# EAGLE design SmartBMSv2 (EAGLE 9.6.2)
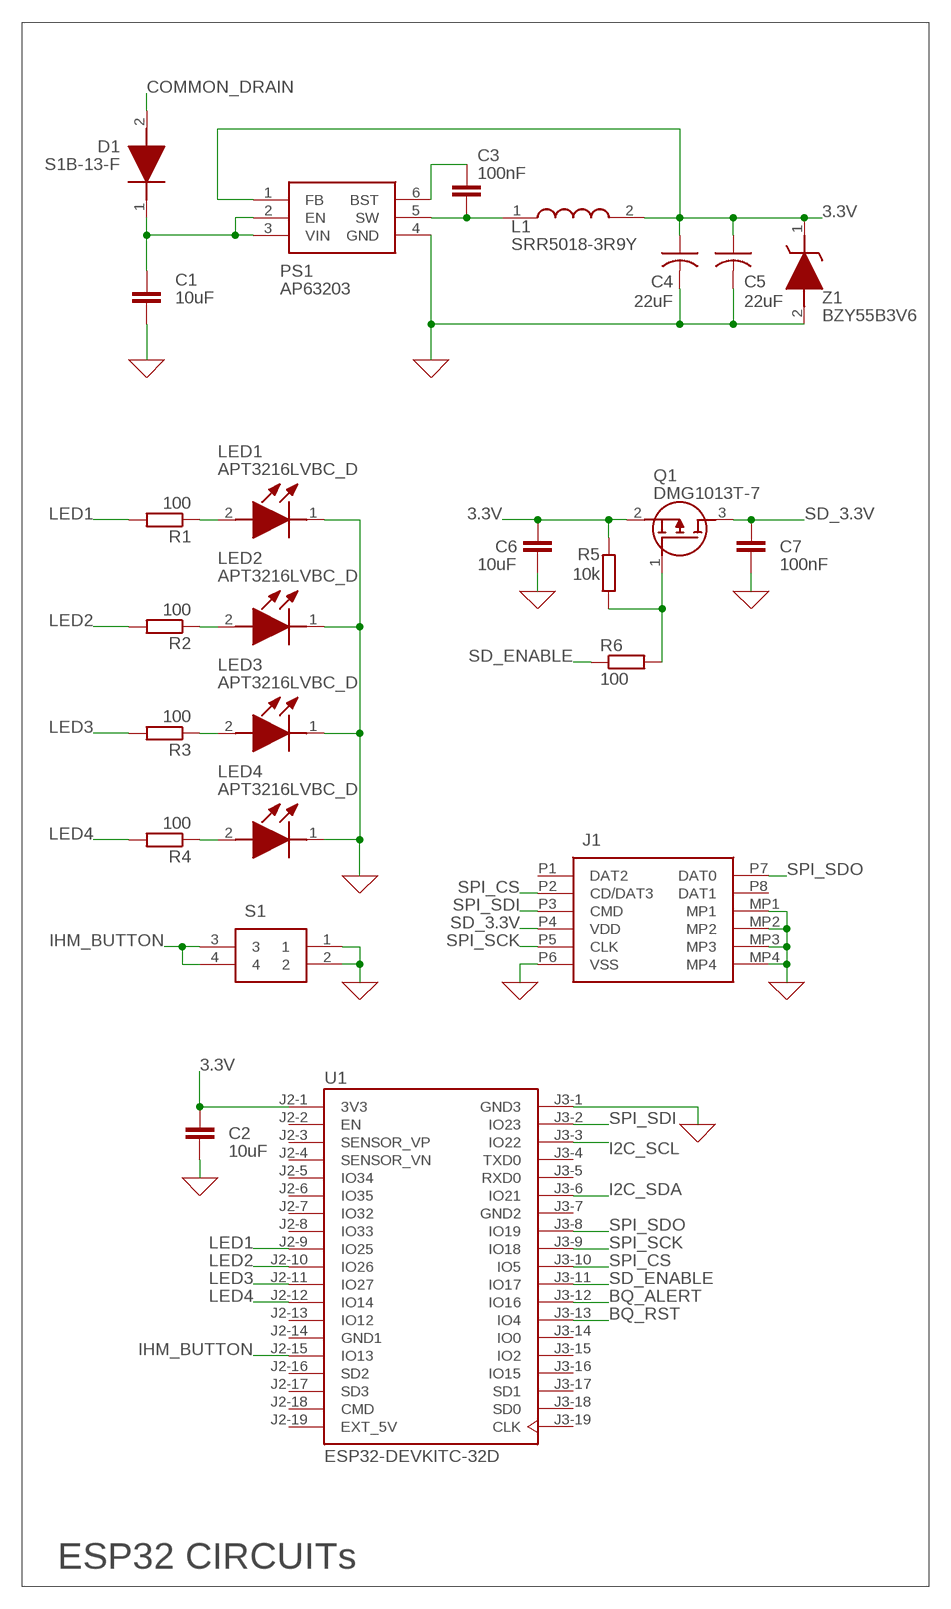
[diagram p0: schematic, sheet 1, part 1 of 2]
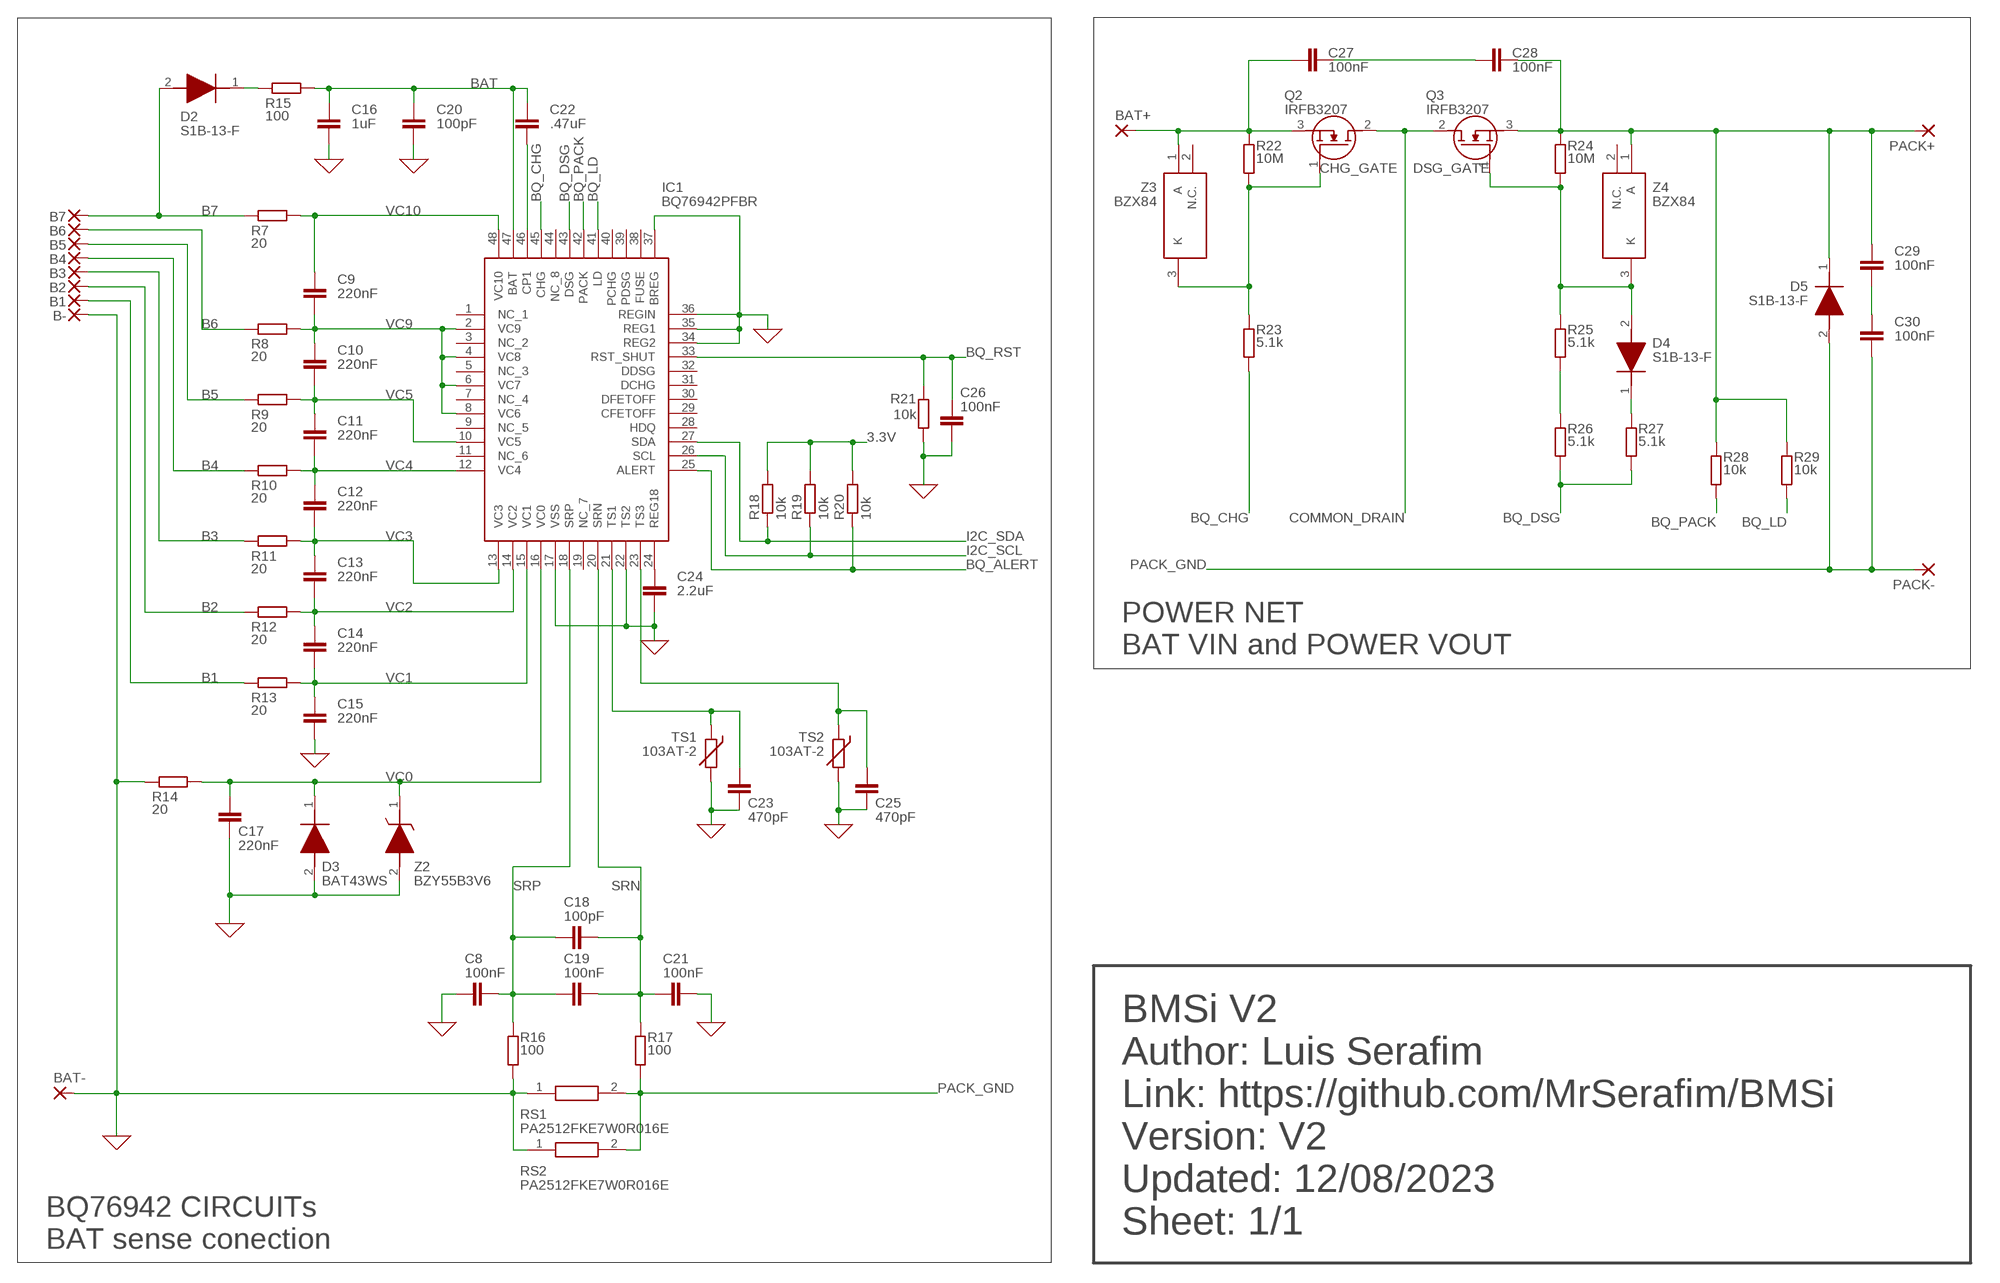
[diagram p1: schematic, sheet 1, part 2 of 2]

## Parts
B1  SMD5  [SMD2,54-5,08]
B2  SMD5  [SMD2,54-5,08]
B3  SMD5  [SMD2,54-5,08]
B4  SMD5  [SMD2,54-5,08]
B5  SMD5  [SMD2,54-5,08]
B6  SMD5  [SMD2,54-5,08]
B7  SMD5  [SMD2,54-5,08]
B-  SMD5  [SMD2,54-5,08]
BAT+  SMD5X10  [SMD5-10]
BAT-  SMD5X10  [SMD5-10]
C1  10uF  C-EUC0805  [C0805]
C2  10uF  C-EUC0805  [C0805]
C3  100nF  C-EUC0805  [C0805]
C4  22uF  C-USC0805  [C0805]
C5  22uF  C-USC0805  [C0805]
C6  10uF  C-EUC0805  [C0805]
C7  100nF  C-EUC0805  [C0805]
C8  100nF  C-EUC0805  [C0805]
C9  220nF  C-EUC0805  [C0805]
C10  220nF  C-EUC0805  [C0805]
C11  220nF  C-EUC0805  [C0805]
C12  220nF  C-EUC0805  [C0805]
C13  220nF  C-EUC0805  [C0805]
C14  220nF  C-EUC0805  [C0805]
C15  220nF  C-EUC0805  [C0805]
C16  1uF  C-EUC0805  [C0805]
C17  220nF  C-EUC0805  [C0805]
C18  100pF  C-EUC0805  [C0805]
C19  100nF  C-EUC0805  [C0805]
C20  100pF  C-EUC0805  [C0805]
C21  100nF  C-EUC0805  [C0805]
C22  .47uF  C-EUC0805  [C0805]
C23  470pF  C-EUC0805  [C0805]
C24  2.2uF  C-EUC0805  [C0805]
C25  470pF  C-EUC0805  [C0805]
C26  100nF  C-EUC0805  [C0805]
C27  100nF  C-EUC0805  [C0805]
C28  100nF  C-EUC0805  [C0805]
C29  100nF  C-EUC0805  [C0805]
C30  100nF  C-EUC0805  [C0805]
D1  S1B-13-F  [DIONM5126X230N]
D2  S1B-13-F  [DIONM5126X230N]
D3  BAT43WS  BAT43WS-E3-08  [SOD2713X115N]
D4  S1B-13-F  [DIONM5126X230N]
D5  S1B-13-F  [DIONM5126X230N]
IC1  BQ76942PFBR  [QFP50P900X900X120-48N]
J1  MEM2067-02-180-00-A  [MEM20670218000A]
L1  SRR5018-3R9Y  [SRR50183R9Y]
LED1  APT3216LVBC_D  [LEDC3216X95N]
LED2  APT3216LVBC_D  [LEDC3216X95N]
LED3  APT3216LVBC_D  [LEDC3216X95N]
LED4  APT3216LVBC_D  [LEDC3216X95N]
PACK+  SMD5X10  [SMD5-10]
PACK-  SMD5X10  [SMD5-10]
PS1  AP63203  AP63203WU-7  [SOT95P280X100-6N]
Q1  DMG1013T-7  [SOT50P160X90-3N]
Q2  IRFB3207  IRFB3207PBF_HOR  [TO220_HORIZONTAL]
Q3  IRFB3207  IRFB3207PBF_HOR  [TO220_HORIZONTAL]
R1  100  R-EU_R0805  [R0805]
R2  100  R-EU_R0805  [R0805]
R3  100  R-EU_R0805  [R0805]
R4  100  R-EU_R0805  [R0805]
R5  10k  R-EU_R0805  [R0805]
R6  100  R-EU_R0805  [R0805]
R7  20  R-EU_R0805  [R0805]
R8  20  R-EU_R0805  [R0805]
R9  20  R-EU_R0805  [R0805]
R10  20  R-EU_R0805  [R0805]
R11  20  R-EU_R0805  [R0805]
R12  20  R-EU_R0805  [R0805]
R13  20  R-EU_R0805  [R0805]
R14  20  R-EU_R0805  [R0805]
R15  100  R-EU_R0805  [R0805]
R16  100  R-EU_R0805  [R0805]
R17  100  R-EU_R0805  [R0805]
R18  10k  R-EU_R0805  [R0805]
R19  10k  R-EU_R0805  [R0805]
R20  10k  R-EU_R0805  [R0805]
R21  10k  R-EU_R0805  [R0805]
R22  10M  R-EU_R0805  [R0805]
R23  5.1k  R-EU_R0805  [R0805]
R24  10M  R-EU_R0805  [R0805]
R25  5.1k  R-EU_R0805  [R0805]
R26  5.1k  R-EU_R0805  [R0805]
R27  5.1k  R-EU_R0805  [R0805]
R28  10k  R-EU_R0805  [R0805]
R29  10k  R-EU_R0805  [R0805]
RS1  PA2512FKE7W0R016E  [RESC6432X88N]
RS2  PA2512FKE7W0R016E  [RESC6432X88N]
S1  FSM2JSMAATR  [FSM2J_1]
TS1  103AT-2  THERMISTOR-2,5  [RS-2,5]
TS2  103AT-2  THERMISTOR-2,5  [RS-2,5]
U1  ESP32-DEVKITC-32D  [MODULE_ESP32-DEVKITC-32D]
Z1  BZY55B3V6  BZY55B3V6_RBG  [DIOC2012X85N]
Z2  BZY55B3V6  BZY55B3V6_RBG  [DIOC2012X85N]
Z3  BZX84  BZX84-C16,215  [SOT95P230X110-3N]
Z4  BZX84  BZX84-C16,215  [SOT95P230X110-3N]

## Nets
0: B-.1(P) BAT-.1(P) C1.2 C2.2 C4.2 C5.2 C6.1 C7.1 C8.1 C15.2 C16.2 C17.2 C20.2 C21.2 C23.2 C24.2 C25.2 C26.2 D3.2(A) IC1.17(VSS) IC1.22(TS2) IC1.34(REG2) IC1.35(REG1) IC1.36(REGIN) IC1.37(BREG) J1.MP1 J1.MP2 J1.MP3 J1.MP4 J1.P6(VSS) LED1.1(K) LED2.1(K) LED3.1(K) LED4.1(K) PS1.4(GND) R14.1 R16.1 R21.1 RS1.1 RS2.1 S1.1 S1.2 TS1.2 TS2.2 U1.J3-1(GND3) Z1.2(A) Z2.2(A) ; supply symbol labelled GND
3.3V: C2.1 C4.1 C5.1 C6.2 L1.2 PS1.1(FB) Q1.2(S) R5.2 R18.2 R19.2 R20.2 U1.J2-1(3V3) Z1.1(K)
B1: B1.1(P) R13.1
B2: B2.1(P) R12.1
B3: B3.1(P) R11.1
B4: B4.1(P) R10.1
B5: B5.1(P) R9.1
B6: B6.1(P) R8.1
B7: B7.1(P) D2.2(A) R7.1
BAT: C16.1 C20.1 C22.1 IC1.47(BAT) R15.2
BAT+: BAT+.1(P) C27.1 Q2.3(S) R22.2 Z3.1(A)
BQ_ALERT: IC1.25(ALERT) R20.1 U1.J3-12(IO16)
BQ_CHG: IC1.45(CHG) R23.1
BQ_DSG: IC1.43(DSG) R26.1 R27.1
BQ_LD: IC1.41(LD) R29.2
BQ_PACK: IC1.42(PACK) R28.2
BQ_RST: C26.1 IC1.33(RST_SHUT) R21.2 U1.J3-13(IO4)
CHG_GATE: Q2.1(G) R22.1 R23.2 Z3.3(K)
COMMON_DRAIN: D1.2(A) Q2.2(D) Q3.2(D)
CP1: C22.2 IC1.46(CP1)
D2_K: D2.1(K) R15.1
DSG_DIODE_K: D4.1(K) R27.2
DSG_GATE: D4.2(A) Q3.1(G) R24.1 R25.2 Z4.3(K)
DSG_RES: R25.1 R26.2
FET_ESDP: C27.2 C28.1
I2C_SCL: IC1.26(SCL) R19.1 U1.J3-3(IO22)
I2C_SDA: IC1.27(SDA) R18.1 U1.J3-6(IO21)
IHM_BUTTON: S1.3 S1.4 U1.J2-15(IO13)
LED1: R1.2 U1.J2-9(IO25)
LED1_ANODE: LED1.2(A) R1.1
LED2: R2.2 U1.J2-10(IO26)
LED2_ANODE: LED2.2(A) R2.1
LED3: R3.2 U1.J2-11(IO27)
LED3_ANODE: LED3.2(A) R3.1
LED4: R4.2 U1.J2-12(IO14)
LED4_ANODE: LED4.2(A) R4.1
PACK+: C28.2 C29.1 D5.1(K) PACK+.1(P) Q3.3(S) R24.2 R28.1 R29.1 Z4.1(A)
PACK_ESDP: C29.2 C30.1
PACK_GND: C30.2 D5.2(A) PACK-.1(P) R17.1 RS1.2 RS2.2
PS1_BST: C3.2 PS1.6(BST)
PS1_SW: C3.1 L1.1 PS1.5(SW)
PS_VIN: C1.1 D1.1(K) PS1.2(EN) PS1.3(VIN)
Q1_GATE: Q1.1(G) R5.1 R6.2
REG18: C24.1 IC1.24(REG18)
SD_3.3V: C7.2 J1.P4(VDD) Q1.3(D)
SD_ENABLE: R6.1 U1.J3-11(IO17)
SPI_CS: J1.P2(CD/DAT3) U1.J3-10(IO5)
SPI_SCK: J1.P5(CLK) U1.J3-9(IO18)
SPI_SDI: J1.P3(CMD) U1.J3-2(IO23)
SPI_SDO: J1.P7(DAT0) U1.J3-8(IO19)
SRN: C18.2 C19.2 C21.1 IC1.20(SRN) R17.2
SRP: C8.2 C18.1 C19.1 IC1.18(SRP) R16.2
TS1: C23.1 IC1.21(TS1) TS1.1
TS3: C25.1 IC1.23(TS3) TS2.1
VC0: C17.1 D3.1(K) IC1.16(VC0) R14.2 Z2.1(K)
VC1: C14.2 C15.1 IC1.15(VC1) R13.2
VC2: C13.2 C14.1 IC1.14(VC2) R12.2
VC3: C12.2 C13.1 IC1.13(VC3) R11.2
VC4: C11.2 C12.1 IC1.12(VC4) R10.2
VC5: C10.2 C11.1 IC1.10(VC5) R9.2
VC9: C9.2 C10.1 IC1.2(VC9) IC1.4(VC8) IC1.6(VC7) IC1.8(VC6) R8.2
VC10: C9.1 IC1.48(VC10) R7.2
Unconnected: IC1.1(NC_1) IC1.3(NC_2) IC1.5(NC_3) IC1.7(NC_4) IC1.9(NC_5) IC1.11(NC_6) IC1.19(NC_7) IC1.28(HDQ) IC1.29(CFETOFF) IC1.30(DFETOFF) IC1.31(DCHG) IC1.32(DDSG) IC1.38(FUSE) IC1.39(PDSG) IC1.40(PCHG) IC1.44(NC_8) J1.P1(DAT2) J1.P8(DAT1) U1.J2-2(EN) U1.J2-3(SENSOR_VP) U1.J2-4(SENSOR_VN) U1.J2-5(IO34) U1.J2-6(IO35) U1.J2-7(IO32) U1.J2-8(IO33) U1.J2-13(IO12) U1.J2-16(SD2) U1.J2-17(SD3) U1.J2-18(CMD) U1.J3-4(TXD0) U1.J3-5(RXD0) U1.J3-14(IO0) U1.J3-15(IO2) U1.J3-16(IO15) U1.J3-17(SD1) U1.J3-18(SD0) U1.J3-19(CLK) Z3.2(N.C.) Z4.2(N.C.)

## Notes on the sheet
- POWER NET
  BAT VIN and POWER VOUT
- BMSi V2
  Author: Luis Serafim
  Link: https://github.com/MrSerafim/BMSi
  Version: V2
  Updated: 12/08/2023
  Sheet: 1/1
- ESP32 CIRCUITs
- BQ76942 CIRCUITs
  BAT sense conection

## Power pins joined to a net without a drawn wire
EXT_5V: U1.J2-19(EXT_5V)
GND1: U1.J2-14(GND1)
GND2: U1.J3-7(GND2)

## Library data of the parts
B1-B7 B- = wirepad:SMD5: SMD PAD
BAT+ BAT- PACK+ PACK- = wirepad:SMD5X10
C1-C3 C6-C30 = rcl:C-EU: CAPACITOR, European symbol; SPICEPREFIX: C
C4 C5 = rcl:C-US: CAPACITOR, American symbol; SPICEPREFIX: C
D1 D2 D4 D5 = SamacSys_Parts:S1B-13-F: Diodes Inc S1B-13-F Switching Diode, 1A 100V, 2-Pin SMA Source: Datasheet <https://componentsearchengine.com/Datasheets/2/S1B-13-F.pdf>; DESCRIPTION: Diodes Inc S1B-13-F Switching Diode, 1A 100V, 2-Pin SMA; HEIGHT: 2.3mm; MANUFACTURER_NAME: Diodes Inc.; MANUFACTURER_PART_NUMBER: S1B-13-F; MOUSER_PART_NUMBER: 621-S1B-F; MOUSER_PRICE-STOCK: https://www.mouser.co.uk/ProductDetail/Diodes-Incorporated/S1B-13-F?qs=zxTnCqfIubBIimUkgF4o7A%3D%3D
D3 = SamacSys_Parts:BAT43WS-E3-08: Schottky Diodes & Rectifiers 30Volt 200mA 4A IFSM Source: Datasheet <https://componentsearchengine.com/Datasheets/1/BAT43WS-E3-08.pdf>; DESCRIPTION: Schottky Diodes & Rectifiers 30Volt 200mA 4A IFSM; HEIGHT: 1.15mm; MANUFACTURER_NAME: Vishay; MANUFACTURER_PART_NUMBER: BAT43WS-E3-08; MOUSER_PART_NUMBER: 78-BAT43WS-E3-08; MOUSER_PRICE-STOCK: https://www.mouser.co.uk/ProductDetail/Vishay-Semiconductors/BAT43WS-E3-08?qs=KP8Io%2FXyE5T4LlUmkdvIAg%3D%3D
IC1 = SamacSys_Parts:BQ76942PFBR: Battery Management 3-series to 10-series multicell battery monitor and protector Source: Datasheet <https://www.ti.com/general/docs/suppproductinfo.tsp?distId=10&gotoUrl=http://www.ti.com/lit/gpn/bq76942>; DESCRIPTION: Battery Management 3-series to 10-series multicell battery monitor and protector; HEIGHT: 1.2mm; MANUFACTURER_NAME: Texas Instruments; MANUFACTURER_PART_NUMBER: BQ76942PFBR; MOUSER_PART_NUMBER: 595-BQ76942PFBR; MOUSER_PRICE-STOCK: https://www.mouser.co.uk/ProductDetail/Texas-Instruments/BQ76942PFBR?qs=IS%252B4QmGtzzpmepW6RmrD8g%3D%3D
J1 = SamacSys_Parts:MEM2067-02-180-00-A: GCT (GLOBAL CONNECTOR TECHNOLOGY) - MEM2067-02-180-00-A - Memory Socket, MEM2067 Series, Memory Card, 8 Contacts, Copper Alloy, Gold Plated Contacts Source: Datasheet <https://gct.co/files/drawings/mem2067.pdf>; DESCRIPTION: GCT (GLOBAL CONNECTOR TECHNOLOGY) - MEM2067-02-180-00-A - Memory Socket, MEM2067 Series, Memory Card, 8 Contacts, Copper Alloy, Gold Plated Contacts; HEIGHT: 1.95mm; MANUFACTURER_NAME: GCT (GLOBAL CONNECTOR TECHNOLOGY); MANUFACTURER_PART_NUMBER: MEM2067-02-180-00-A; MOUSER_PART_NUMBER: 640-MEM20670218000A; MOUSER_PRICE-STOCK: https://www.mouser.co.uk/ProductDetail/GCT/MEM2067-02-180-00-A?qs=KUoIvG%2F9IlYTw%2Fcc1GlNJA%3D%3D
L1 = SamacSys_Parts:SRR5018-3R9Y: Power Inductors - SMD 3.9uH 30% SMD 5018 Source: Datasheet <https://www.bourns.com/docs/Product-Datasheets/SRR5018.pdf>; DESCRIPTION: Power Inductors - SMD 3.9uH 30% SMD 5018; HEIGHT: 2mm; MANUFACTURER_NAME: Bourns; MANUFACTURER_PART_NUMBER: SRR5018-3R9Y; MOUSER_PART_NUMBER: 652-SRR5018-3R9Y; MOUSER_PRICE-STOCK: https://www.mouser.co.uk/ProductDetail/Bourns/SRR5018-3R9Y?qs=s%252BX%2FYkvGCpHN8m52wHNyuw%3D%3D
LED1-LED4 = SamacSys_Parts:APT3216LVBC_D: Standard LEDs - SMD 3.2X1.6MM LOW CRNT Source: Datasheet <https://ms.componentsearchengine.com/Datasheets/1/APT3216LVBC_D.pdf>; DESCRIPTION: Standard LEDs - SMD 3.2X1.6MM LOW CRNT; HEIGHT: 0.95mm; MANUFACTURER_NAME: Kingbright; MANUFACTURER_PART_NUMBER: APT3216LVBC/D; MOUSER_PART_NUMBER: 604-APT3216LVBCD; MOUSER_PRICE-STOCK: https://www.mouser.co.uk/ProductDetail/Kingbright/APT3216LVBC-D?qs=6oMev5NRZMHkh%2FkgOlUYsw%3D%3D
PS1 = SamacSys_Parts:AP63203WU-7: Switching Voltage Regulators DCDC Conv HV Buck TSOT26 T&R 3K Source: Datasheet <https://componentsearchengine.com/Datasheets/1/AP63203WU-7.pdf>; DESCRIPTION: Switching Voltage Regulators DCDC Conv HV Buck TSOT26 T&R 3K; HEIGHT: 1mm; MANUFACTURER_NAME: Diodes Inc.; MANUFACTURER_PART_NUMBER: AP63203WU-7; MOUSER_PART_NUMBER: 621-AP63203WU-7; MOUSER_PRICE-STOCK: https://www.mouser.co.uk/ProductDetail/Diodes-Incorporated/AP63203WU-7?qs=u16ybLDytRZ1JqxbuLkMJw%3D%3D
Q1 = SamacSys_Parts:DMG1013T-7: MOSFET P-Channel 20V 0.46A SOT523 Diodes Inc DMG1013T-7 P-channel MOSFET Transistor, -0.46 A, -20 V, 3-Pin SOT-523 Source: Datasheet <https://componentsearchengine.com/Datasheets/2/DMG1013T-7.pdf>; DESCRIPTION: MOSFET P-Channel 20V 0.46A SOT523 Diodes Inc DMG1013T-7 P-channel MOSFET Transistor, -0.46 A, -20 V, 3-Pin SOT-523; HEIGHT: 0.9mm; MANUFACTURER_NAME: Diodes Inc.; MANUFACTURER_PART_NUMBER: DMG1013T-7; MOUSER_PART_NUMBER: 621-DMG1013T-7; MOUSER_PRICE-STOCK: https://www.mouser.co.uk/ProductDetail/Diodes-Incorporated/DMG1013T-7?qs=vIZ3oKQCLxoGXqzcu%252B%2F97Q%3D%3D
Q2 Q3 = SamacSys_Parts:IRFB3207PBF: MOSFET MOSFT 75V 180A 4.5mOhm 180nC Source: Datasheet
R1-R29 = rcl:R-EU_: RESISTOR, European symbol; SPICEPREFIX: R
RS1 RS2 = SamacSys_Parts:PA2512FKE7W0R016E: 16 mOhms +/-1% 2W Chip Resistor 2512 (6432 Metric) Anti-Sulfur, Automotive AEC-Q200, Current Sense, Moisture Resistant Metal Element Source: Datasheet <https://www.yageo.com/upload/media/product/productsearch/datasheet/rchip/PYu-PA_E_51_RoHS_10.pdf>; DESCRIPTION: 16 mOhms +/-1% 2W Chip Resistor 2512 (6432 Metric) Anti-Sulfur, Automotive AEC-Q200, Current Sense, Moisture Resistant Metal Element; HEIGHT: 0.88mm; MANUFACTURER_NAME: YAGEO; MANUFACTURER_PART_NUMBER: PA2512FKE7W0R016E
S1 = SamacSys_Parts:FSM2JSMAATR: Tactile switch,SMT,SPST,raised white act Source: Datasheet <http://www.te.com/commerce/DocumentDelivery/DDEController?Action=showdoc&DocId=Customer Drawing2-1437565-7VpdfEnglishENG_CD_2-1437565-7_V.pdf2-1437565-9>; DESCRIPTION: Tactile switch,SMT,SPST,raised white act; HEIGHT: mm; MANUFACTURER_NAME: TE Connectivity; MANUFACTURER_PART_NUMBER: FSM2JSMAATR; MOUSER_PART_NUMBER: 506-FSM2JSMAATR; MOUSER_PRICE-STOCK: https://www.mouser.co.uk/ProductDetail/TE-Connectivity-Alcoswitch/FSM2JSMAATR?qs=g%252BEszo6zu8MKdISiZRITCQ%3D%3D
TS1 TS2 = varistor:THERMISTOR: THERMISTOR
U1 = ESP32-DEVKITC-32D:ESP32-DEVKITC-32D: Check availability <https://pricing.snapeda.com/parts/ESP32-DEVKITC-32D/Espressif%20Systems/view-part?ref=eda>; AVAILABILITY: In Stock; DESCRIPTION: WiFi Development Tools (802.11) ESP32 General Development Kit, ESP32-WROOM-32D on the board; MF: Espressif Systems; MP: ESP32-DEVKITC-32D; PACKAGE: None; PRICE: None; PURCHASE-URL: https://pricing.snapeda.com/search?q=ESP32-DEVKITC-32D&ref=eda
Z1 Z2 = SamacSys_Parts:BZY55B3V6_RBG: Zener Diodes 0805 500mW 2% Small Signal Zener Diode Source: Datasheet <https://www.mouser.de/ProductDetail/Taiwan-Semiconductor/BZY55B3V6-RBG/?qs=mAH9sUMRCtv1hjtg7HbTxw==>; DESCRIPTION: Zener Diodes 0805 500mW 2% Small Signal Zener Diode; HEIGHT: 0.85mm; MANUFACTURER_NAME: Taiwan Semiconductor; MANUFACTURER_PART_NUMBER: BZY55B3V6 RBG; MOUSER_PART_NUMBER: 821-BZY55B3V6RBG; MOUSER_PRICE-STOCK: https://www.mouser.co.uk/ProductDetail/Taiwan-Semiconductor/BZY55B3V6-RBG?qs=mAH9sUMRCtv1hjtg7HbTxw%3D%3D
Z3 Z4 = SamacSys_Parts:BZX84-C16,215: Zener Diode 16 V 250 mW +/-5% Surface Mount TO-236AB Source: Datasheet <https://assets.nexperia.com/documents/data-sheet/BZX84_SER.pdf>; DESCRIPTION: Zener Diode 16 V 250 mW +/-5% Surface Mount TO-236AB; HEIGHT: 1.1mm; MANUFACTURER_NAME: Nexperia; MANUFACTURER_PART_NUMBER: BZX84-C16,215; MOUSER_PART_NUMBER: 771-BZX84-C16-T/R; MOUSER_PRICE-STOCK: https://www.mouser.co.uk/ProductDetail/Nexperia/BZX84-C16215?qs=me8TqzrmIYVsB4WuERPteg%3D%3D

## Board
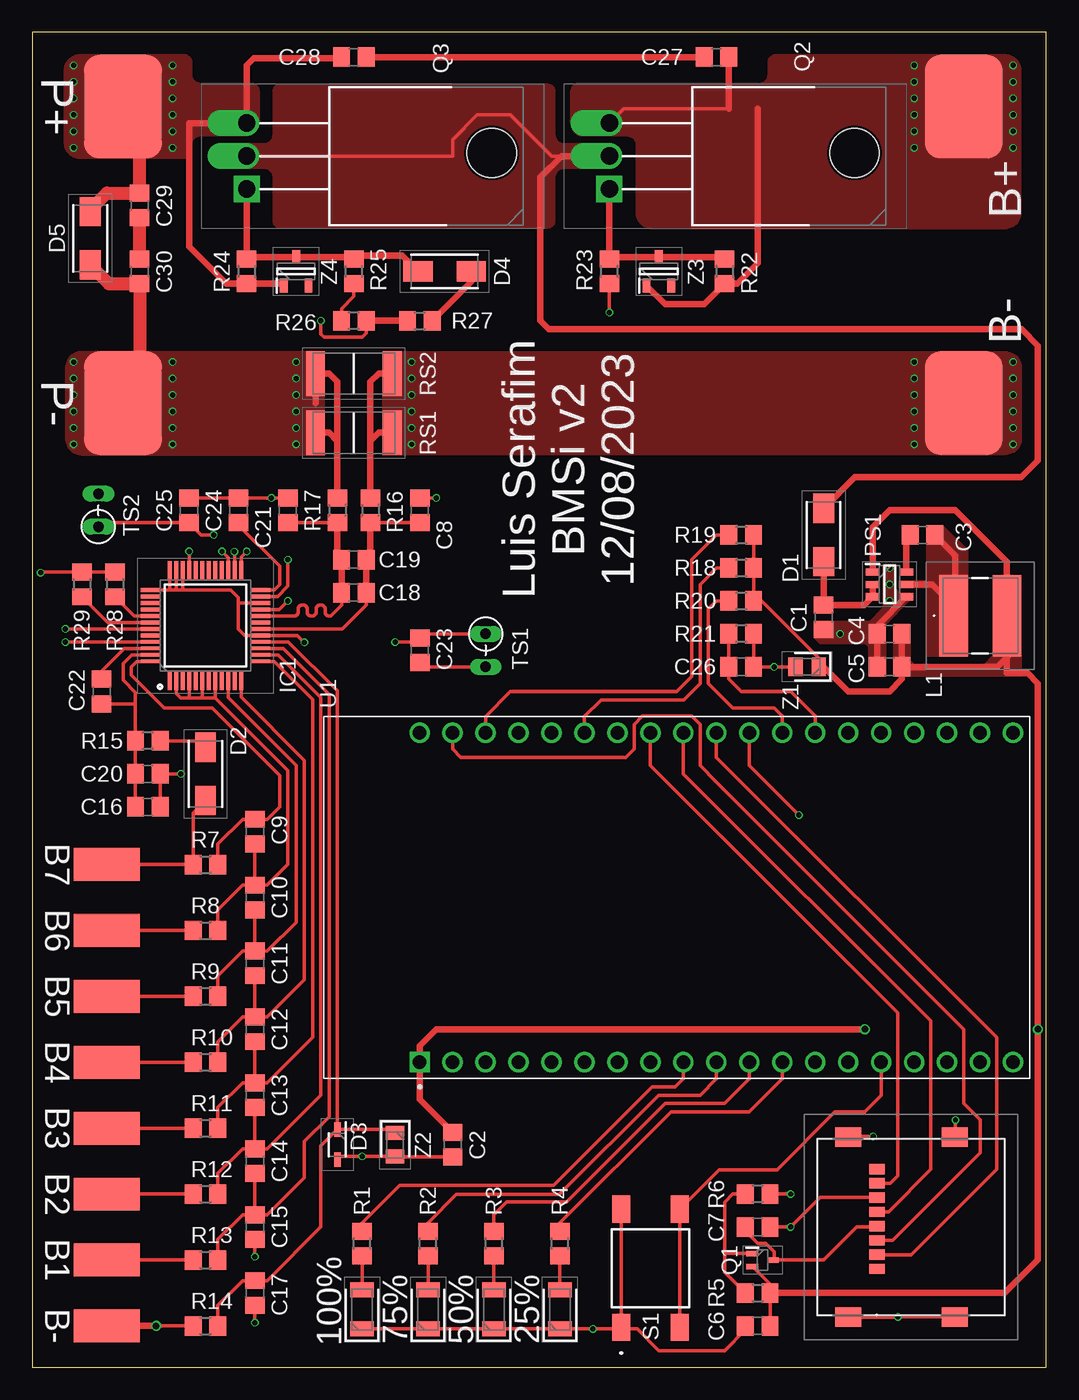
[diagram p2: board, top side]
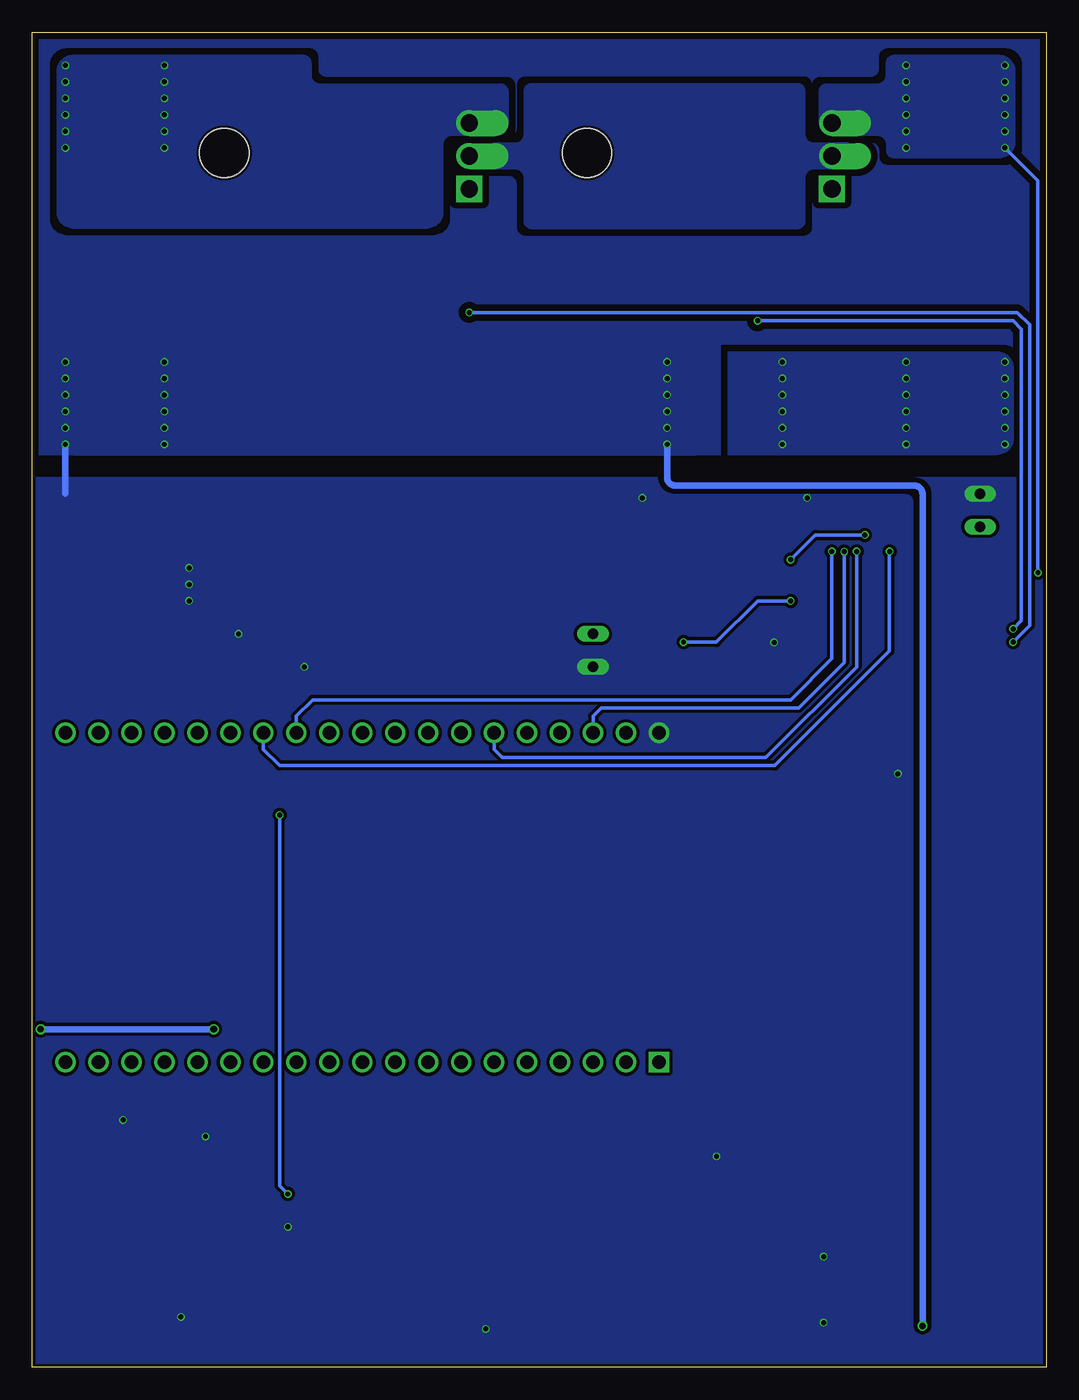
[diagram p3: board, bottom side, seen from below]

Size 78.11 x 102.87 mm. Coordinates in mm from the lower left corner, seen from the top.
Outline: 0,0 78.11,0 78.11,102.87 0,102.87 0,0
Copper layers (1*16): Top 0.035559375mm / dielectric 1.6mm / Bottom 0.035559375mm
Design rules "jlcpcb2layer": minimum track width 5mil, minimum drill 12mil, track to track 5mil, track to pad 5mil, pad to pad 5mil, via to via 5mil, smd to smd 5mil, copper to edge 8mil, drill to drill 6mil, minimum pad ring 5mil, minimum via ring 3mil, stop-mask expansion 2.5mil, vias tented up to drill 0mil, thermal gap 10mil

### Footprints (pad centres in the part's own frame; a part is rotated, then mirrored left to right if it is on the bottom)
SMD2,54-5,08 = smd 2.54 x 5.08: 1 0,0
SMD5-10 = smd 8 x 6: 1 0,0
C0805 = smd 1.3 x 1.5: 1 -0.95,0; 2 0.95,0
DIONM5126X230N = smd 2.25 x 1.6: 1 -2.05,0; 2 2.05,0
SOD2713X115N = smd 1.125 x 0.5: 1 -1.162,0; 2 1.162,0
QFP50P900X900X120-48N = smd 1.475 x 0.3: 1 -4.238,2.75; 2 -4.238,2.25; 3 -4.238,1.75; 4 -4.238,1.25; 5 -4.238,0.75; 6 -4.238,0.25; 7 -4.238,-0.25; 8 -4.238,-0.75; 9 -4.238,-1.25; 10 -4.238,-1.75; 11 -4.238,-2.25; 12 -4.238,-2.75; 25 4.238,-2.75; 26 4.238,-2.25; 27 4.238,-1.75; 28 4.238,-1.25; 29 4.238,-0.75; 30 4.238,-0.25; 31 4.238,0.25; 32 4.238,0.75; 33 4.238,1.25; 34 4.238,1.75; 35 4.238,2.25; 36 4.238,2.75 | smd 0.3 x 1.475: 13 -2.75,-4.238; 14 -2.25,-4.238; 15 -1.75,-4.238; 16 -1.25,-4.238; 17 -0.75,-4.238; 18 -0.25,-4.238; 19 0.25,-4.238; 20 0.75,-4.238; 21 1.25,-4.238; 22 1.75,-4.238; 23 2.25,-4.238; 24 2.75,-4.238; 37 2.75,4.238; 38 2.25,4.238; 39 1.75,4.238; 40 1.25,4.238; 41 0.75,4.238; 42 0.25,4.238; 43 -0.25,4.238; 44 -0.75,4.238; 45 -1.25,4.238; 46 -1.75,4.238; 47 -2.25,4.238; 48 -2.75,4.238
MEM20670218000A = smd 1.5 x 2: MP1 -6.945,0; MP2 6.945,0; MP3 6.945,8.2; MP4 -6.945,8.2 | smd 0.8 x 1.2: P1 3.225,2.2; P2 2.125,2.2; P3 1.025,2.2; P4 -0.075,2.2; P5 -1.175,2.2; P6 -2.275,2.2; P7 -3.375,2.2; P8 -4.475,2.2
SRR50183R9Y = smd 6.3 x 2.2: 1 0,-2.05; 2 0,2.05
LEDC3216X95N = smd 1.15 x 1.8: 1 -1.5,0; 2 1.5,0
SOT95P280X100-6N = smd 1.05 x 0.55: 1 -1.3,0.95; 2 -1.3,0; 3 -1.3,-0.95; 4 1.3,-0.95; 5 1.3,0; 6 1.3,0.95
SOT50P160X90-3N = smd 0.9 x 0.4: 1 -0.8,0.5; 2 -0.8,-0.5; 3 0.8,0
TO220_HORIZONTAL = drill 1.34 pad 2.01 square: 1 0,0 | drill 1.34 pad 2.01 offset: 2 2.54,0; 3 5.08,0 | hole 3.8: 2.78,-18.88
R0805 = smd 1.3 x 1.5: 1 -0.95,0; 2 0.95,0
RESC6432X88N = smd 1.45 x 3.45: 1 -2.95,0; 2 2.95,0
FSM2J_1 = smd 1.4 x 2.1: 1 2.25,4.55; 2 2.25,-4.55; 3 -2.25,4.55; 4 -2.25,-4.55
RS-2,5 = drill 0.813 long: 1 -1.27,0; 2 1.27,0
MODULE_ESP32-DEVKITC-32D = drill 1.04 square: J2-1 -12.7,19.76 | drill 1.04: J2-2 -12.7,17.22; J2-3 -12.7,14.68; J2-4 -12.7,12.14; J2-5 -12.7,9.6; J2-6 -12.7,7.06; J2-7 -12.7,4.52; J2-8 -12.7,1.98; J2-9 -12.7,-0.56; J2-10 -12.7,-3.1; J2-11 -12.7,-5.64; J2-12 -12.7,-8.18; J2-13 -12.7,-10.72; J2-14 -12.7,-13.26; J2-15 -12.7,-15.8; J2-16 -12.7,-18.34; J2-17 -12.7,-20.88; J2-18 -12.7,-23.42; J2-19 -12.7,-25.96; J3-1 12.7,19.76; J3-2 12.7,17.22; J3-3 12.7,14.68; J3-4 12.7,12.14; J3-5 12.7,9.6; J3-6 12.7,7.06; J3-7 12.7,4.52; J3-8 12.7,1.98; J3-9 12.7,-0.56; J3-10 12.7,-3.1; J3-11 12.7,-5.64; J3-12 12.7,-8.18; J3-13 12.7,-10.72; J3-14 12.7,-13.26; J3-15 12.7,-15.8; J3-16 12.7,-18.34; J3-17 12.7,-20.88; J3-18 12.7,-23.42; J3-19 12.7,-25.96
DIOC2012X85N = smd 1.1 x 1.45: 1 -0.9,0; 2 0.9,0
SOT95P230X110-3N = smd 1.05 x 0.6: 1 -1.1,0.95; 2 -1.1,-0.95; 3 1.1,0

### Placement (x,y rotation side)
B1  5.71,8.26 90 top
B2  5.71,13.34 90 top
B3  5.71,18.41 90 top
B4  5.71,23.49 90 top
B5  5.71,28.57 90 top
B6  5.71,33.66 90 top
B7  5.71,38.73 90 top
B-  5.71,3.17 90 top
BAT+  71.75,97.16 270 top
BAT-  71.75,74.3 90 top
C1  60.96,57.79 270 top
C2  32.38,17.14 270 top
C3  68.58,64.13 180 top
C4  66.04,56.52 180 top
C5  66.04,53.98 180 top
C6  55.88,3.17 0 top
C7  55.88,10.79 180 top
C8  29.85,66.04 270 top
C9  17.14,41.27 270 top
C10  17.14,36.2 270 top
C11  17.14,31.11 270 top
C12  17.14,26.04 270 top
C13  17.14,20.95 270 top
C14  17.14,15.88 270 top
C15  17.14,10.79 270 top
C16  8.89,43.18 0 top
C17  17.14,5.71 270 top
C18  24.77,59.69 180 top
C19  24.77,62.23 180 top
C20  8.89,45.72 0 top
C21  19.69,66.04 90 top
C22  5.33,52.07 90 top
C23  29.85,55.25 270 top
C24  15.88,66.04 90 top
C25  12.06,66.04 90 top
C26  54.61,53.98 0 top
C27  52.7,100.96 180 top
C28  24.77,100.96 180 top
C29  8.25,89.53 270 top
C30  8.25,84.45 270 top
D1  60.96,64.13 90 top
D2  13.33,45.72 270 top
D3  23.5,17.14 270 top
D4  31.75,84.45 180 top
D5  4.45,86.99 270 top
IC1  13.33,57.15 90 top
J1  62.87,10.79 270 top
L1  73.03,57.91 270 top
LED1  25.4,4.45 90 top
LED2  30.48,4.45 90 top
LED3  35.56,4.45 90 top
LED4  40.64,4.45 90 top
PACK+  6.99,97.16 90 top
PACK-  6.99,74.3 90 top
PS1  66.04,60.33 0 top
Q1  56.26,8.26 0 top
Q2  44.45,90.8 90 top
Q3  16.51,90.8 90 top
R1  25.4,9.53 90 top
R2  30.48,9.53 90 top
R3  35.56,9.53 90 top
R4  40.64,9.53 90 top
R5  55.88,5.71 0 top
R6  55.88,13.34 180 top
R7  13.33,38.73 0 top
R8  13.33,33.66 0 top
R9  13.33,28.57 0 top
R10  13.33,23.49 0 top
R11  13.33,18.41 0 top
R12  13.33,13.34 0 top
R13  13.33,8.26 0 top
R14  13.33,3.17 0 top
R15  8.89,48.26 180 top
R16  26.04,66.04 270 top
R17  23.5,66.04 270 top
R18  54.61,61.59 0 top
R19  54.61,64.13 0 top
R20  54.61,59.05 0 top
R21  54.61,56.52 180 top
R22  53.34,84.45 270 top
R23  44.45,84.45 90 top
R24  16.51,84.45 270 top
R25  24.77,84.45 90 top
R26  24.77,80.64 180 top
R27  29.85,80.64 0 top
R28  3.81,60.33 270 top
R29  6.35,60.33 270 top
RS1  24.77,72.01 180 top
RS2  24.77,76.58 180 top
S1  47.62,7.62 180 top
TS1  34.93,55.25 270 top
TS2  5.08,66.04 90 top
U1  49.59,36.2 90 top
Z1  59.69,53.98 180 top
Z2  27.94,17.14 270 top
Z3  48.26,84.45 90 top
Z4  20.32,84.45 90 top

### Tracks (layer width: path | path; a pad name or v marks a point on that pad's centre or on a via)
0  (via drill 0.38, 0.51)
  Top 0.254: R14.1 B-.1 | 15.88,58.93 15.88,56.9 16.37,56.4 IC1.17 20.41,56.4 v20.96,55.85 | IC1.37 10.54,59.9 | 10.54,59.9 11.18,59.9 | 11.18,59.9 11.56,59.9 | 11.56,59.9 15.28,59.9 15.88,59.31 15.88,58.93 | 15.88,58.93 15.9,58.9 IC1.22 | IC1.34 11.58,59.93 11.56,59.9 | IC1.35 11.08,59.99 11.18,59.9 | IC1.36 10.58,59.94 10.54,59.9 | C16.2 C20.2 v11.43,45.72 | R21.1 C26.2 v57.15,53.98 Z1.2 | C23.2 30.17,53.98 TS1.2 | C7.1 v58.42,10.79 60.7,13.07 J1.P6 | J1.MP4 71.12,17.79 v71.12,19.05 | J1.MP1 62.91,17.78 v64.77,17.78 | LED1.1 LED2.1 LED3.1 LED4.1 v43.18,2.95 45.38,2.95 S1.1 | S1.2 S1.1 | S1.1 45.5,2.94 46.59,2.94 48.26,1.27 53.34,1.27 54.93,2.86 C6.1 | C2.2 27.99,16.19 Z2.2 v25.4,16.24 23.76,16.24 D3.2 | C15.2 v17.14,8.51 | C17.2 v17.14,3.43 | J1.MP2 66.66,3.85 v66.67,3.86 71.05,3.86 J1.MP3 | C21.2 v18.42,66.99 v18.41,66.99 C24.2 C25.2 | v31.12,66.99 C8.1
  Top 0.508: C5.2 C4.2 65.09,57.12 PS1.4 | B-.1 v9.53,3.17 | 26.04,71.37 R16.1 | RS1.1 26.67,72.01 26.04,71.37 | RS2.1 26.67,76.58 26.04,75.95 26.04,71.37
  Bottom 0.508: v9.53,3.17 9.53,67.31 arc-90 10.16,67.94 28.58,67.94 arc90 29.21,68.58 v29.21,71.12 | v75.56,71.12 75.56,67.31
  other vias: 75.56,77.47 75.56,76.2 75.56,74.93 75.56,73.66 75.56,72.39 67.95,71.12 67.95,72.39 67.95,73.66 67.95,74.93 67.95,76.2 67.95,77.47 29.21,77.47 29.21,76.2 29.21,74.93 29.21,73.66 29.21,72.39 66.04,61.59 66.04,60.33 66.04,59.05 62.23,56.52
  pour Top (no thermals): 27,78.28 74.93,78.28 arc-90 76.2,77.01 76.2,71.58 arc-90 74.93,70.31 27,70.31
  pour Top (no thermals): 27,78.28 74.93,78.28 arc-90 76.2,77.01 76.2,71.58 arc-90 74.93,70.31 27,70.31
  pour Bottom (no thermals): 27,78.28 74.93,78.28 arc-90 76.2,77.01 76.2,71.58 arc-90 74.93,70.31 27,70.31
  pour Bottom (isolate 0.508, rank 2, no thermals): 0,70.31 78.11,70.31 78.11,102.87 0,102.87
  pour Bottom (isolate 0.254, no thermals): 0,0 78.11,0 78.11,68.58 0,68.58
  cutout Bottom (no thermals): 29.85,68.58 10.16,68.58 arc90 8.89,67.31 8.89,3.17 arc90 9.53,2.54 arc90 10.16,3.17 10.16,66.67 arc-90 10.79,67.31 28.58,67.31 arc90
  pour Top (no thermals): 67.84,59.64 66.83,59.64 66.55,59.92 66.55,61.85 65.53,61.85 65.53,58.5 64.44,57.4 64.44,55.75 65.74,55.75 65.74,57.25 67.59,59.11 67.84,59.11
  pour Top (no thermals): 60.22,57.48 60.22,56.18 60.66,55.75 64.19,55.75 64.44,55.5 64.44,55.25 64.77,55.25 64.77,57.48
  pour Top (no thermals): 65.74,55.88 65.74,53.24 64.44,53.24 64.44,55.88
3.3V  (via drill 0.51)
  Top 0.254: Q1.2 56.83,6.39 R5.2 C6.2 | L1.2 75.38,57.6 75.38,55.01 | Z1.1 60.59,54.66 56.2,59.05 R20.2 R18.2 R19.2
  Top 0.508: C4.1 C5.1 | C5.1 74.35,53.98 75.38,55.01 | PS1.1 64.74,64.74 66.04,66.04 71.12,66.04 75.08,62.09 L1.2 75.08,53.49 76.68,53.49 77.47,52.71 v77.47,26.04 77.47,8.26 74.93,5.71 R5.2 | C2.1 29.85,20.63 29.85,23.48 U1.J2-1 29.83,24.75 31.12,26.04 v64.13,26.04 | Z1.1 60.96,53.98 62.87,52.07 66.04,52.07 66.99,53.02 C5.1
  Bottom 0.508: v64.13,26.04 v77.47,26.04
  pour Top (no thermals): 67.64,57.25 67.64,54.46 67.89,54.2 73.38,54.2 74.04,54.86 76.17,54.86 76.17,53.24 66.34,53.24 66.34,57.25
B1
  Top 0.254: B1.1 R13.1
B2
  Top 0.254: B2.1 R12.1
B3
  Top 0.254: B3.1 R11.1
B4
  Top 0.254: B4.1 R10.1
B5
  Top 0.254: R9.1 B5.1
B6
  Top 0.254: R8.1 B6.1
B7
  Top 0.254: B7.1 R7.1 12.38,42.72 D2.2
BAT
  Top 0.254: C16.1 C20.1 R15.2 7.94,51.12 | IC1.47 7.66,54.9 6.99,54.23 6.99,52.96 7.94,52 7.94,51.12 | 7.94,51.12 C22.1
BAT+  (via drill 0.38)
  Top 0.254: Q2.3 45.55,96.98 53.66,96.98
  Top 0.508: Z3.1 48.75,81.91 51.75,81.91 R22.2 54.3,83.5 55.88,85.09 55.88,96.98 | C27.1 53.66,96.98
  other vias: 67.95,93.98 67.95,95.25 67.95,96.52 67.95,97.79 67.95,99.06 67.95,100.33 75.56,93.98 75.56,95.25 75.56,96.52 75.56,97.79 75.56,99.06 75.56,100.33
  pour Top (no thermals): 42.55,94.89 45.85,94.89 arc-90 46.48,94.26 46.48,89.03 arc90 47.75,87.76 74.93,87.76 arc90 76.2,89.03 76.2,99.87 arc90 74.93,101.14 57.28,101.14 arc90 56.64,100.51 56.64,99.57 arc-90 56.01,98.93 42.09,98.93 arc90 41.45,98.3 41.45,95.88 arc90 42.44,94.89
  pour Bottom (no thermals): 42.44,94.89 45.85,94.89 arc-90 46.48,94.26 46.48,89.03 arc90 47.75,87.76 74.93,87.76 arc90 76.2,89.03 76.2,99.87 arc90 74.93,101.14 57.28,101.14 arc90 56.64,100.51 56.64,99.57 arc-90 56.01,98.93 42.09,98.93 arc90 41.45,98.3 41.45,95.88 arc90
BQ_ALERT  (via drill 0.38)
  Top 0.254: R20.1 52.7,59.05 52.07,58.42 52.07,52.71 53.98,50.8 57.15,50.8 57.79,50.16 U1.J3-12 | IC1.25 16.09,62.44 v16.51,62.87
  Bottom 0.254: U1.J3-12 57.79,50.16 56.52,51.44 19.69,51.44 16.51,54.61 v16.51,62.87
BQ_CHG  (via drill 0.38)
  Top 0.254: IC1.45 9.08,55.88 v2.54,55.88 | v44.45,81.28 R23.1
  Bottom 0.254: v2.54,55.88 1.27,57.15 1.27,80.34 2.21,81.28 v44.45,81.28
BQ_DSG  (via drill 0.38)
  Top 0.254: v2.54,56.9 IC1.43 | v22.23,80.64 22.23,79.63 22.48,79.38 25.4,79.38 25.71,79.69 R26.1
  Top 0.508: R27.1 R26.1
  Bottom 0.254: v2.54,56.9 1.91,57.54 1.91,80.01 2.54,80.64 v22.23,80.64
BQ_LD
  Top 0.254: R29.2 7.83,57.9 IC1.41
BQ_PACK
  Top 0.254: R28.2 5.79,57.4 IC1.42
BQ_RST  (via drill 0.38)
  Top 0.254: U1.J3-13 60.31,50.18 58.42,52.07 54.61,52.07 53.66,53.02 C26.1 R21.2 | IC1.33 12.08,62.84 v12.06,62.87
  Bottom 0.254: U1.J3-13 60.31,47.61 59.05,46.36 20.9,46.36 12.08,55.18 12.08,62.85 v12.06,62.87
CHG_GATE
  Top 0.254: 53.19,85.55 R22.1 | 44.45,85.55 R23.2
  Top 0.508: 53.19,85.55 Z3.3 44.45,85.55 | R23.2 Q2.1
COMMON_DRAIN
  Top 0.254: Q3.2 32.38,93.34 32.38,94.61 34.29,96.52 36.83,96.52 40.01,93.34 41.91,93.34
  Top 0.508: 41.91,93.34 Q2.2 40.77,93.34 39.12,91.69 39.12,80.64 39.78,79.98 76.22,79.98 77.47,78.74 77.47,69.85 76.2,68.58 63.36,68.58 D1.2
  pour Top (no thermals): 15.24,92.35 15.24,94.34 17.91,94.34 arc90 18.54,94.97 18.54,98.3 arc-90 19.18,98.93 39.62,98.93 arc-90 40.26,98.3 40.26,94.97 arc90 40.89,94.34 42.67,94.34 42.67,92.35 40.89,92.35 arc90 40.26,91.72 40.26,88.39 arc-90 39.62,87.76 19.18,87.76 arc-90 18.54,88.39 18.54,91.72 arc90 17.91,92.35
  pour Bottom (no thermals): 15.24,92.35 15.24,94.34 17.91,94.34 arc90 18.54,94.97 18.54,98.3 arc-90 19.18,98.93 39.62,98.93 arc-90 40.26,98.3 40.26,94.97 arc90 40.89,94.34 42.67,94.34 42.67,92.35 40.89,92.35 arc90 40.26,91.72 40.26,88.39 arc-90 39.62,87.76 19.18,87.76 arc-90 18.54,88.39 18.54,91.72 arc90 17.91,92.35
CP1
  Top 0.254: C22.2 5.33,53.66 7.08,55.4 IC1.46
D2_K
  Top 0.254: R15.1 12.84,48.26 D2.1
DSG_DIODE_K
  Top 0.508: R27.2 33.8,83.65 D4.1
DSG_GATE
  Top 0.254: R24.1 16.66,85.55 | 24.62,85.55 R25.2
  Top 0.508: 16.66,85.55 Z4.3 24.62,85.55 | R25.2 25.02,85.66 28.5,85.66 D4.2 | Q3.1 R24.1
DSG_RES
  Top 0.254: R25.1 24.77,82.55 23.82,81.6 R26.2
FET_ESDP
  Top 0.508: C28.1 C27.2
I2C_SCL  (via drill 0.38)
  Top 0.254: U1.J3-3 34.91,50.15 36.83,52.07 49.66,52.07 50.8,53.21 50.8,60.96 50.8,61.27 50.8,62.23 52.7,64.13 R19.1 | IC1.26 15.58,62.83 v15.56,62.85
  Bottom 0.254: v15.56,62.85 15.56,54.29 19.05,50.8 34.28,50.8 34.91,50.16 U1.J3-3
I2C_SDA  (via drill 0.38)
  Top 0.254: U1.J3-6 42.53,50.15 43.81,51.44 50.16,51.44 51.44,52.71 51.44,60.33 52.7,61.59 R18.1 | IC1.27 15.08,62.39 v14.6,62.87
  Bottom 0.254: v14.6,62.87 14.6,53.98 21.59,46.99 41.91,46.99 42.53,47.61 U1.J3-6
IHM_BUTTON
  Top 0.254: S1.3 S1.4 52.92,15.22 57.37,15.22 61.84,19.68 64.13,19.68 65.39,20.94 U1.J2-15
LED1
  Top 0.254: R1.2 25.4,11.11 28.29,14 40.16,14 47.75,21.59 49.53,21.59 50.15,22.21 U1.J2-9
LED1_ANODE
  Top 0.254: R1.1 LED1.2
LED2
  Top 0.254: R2.2 30.48,11.11 32.67,13.3 40.61,13.3 48.26,20.95 51.44,20.95 52.7,22.22 52.7,23.48 U1.J2-10
LED2_ANODE
  Top 0.254: R2.1 LED2.2
LED3
  Top 0.254: R3.2 35.56,11.75 36.55,12.73 41.18,12.73 48.77,20.32 53.34,20.32 55.25,22.22 55.25,23.48 U1.J2-11
LED3_ANODE
  Top 0.254: R3.1 LED3.2
LED4
  Top 0.254: R4.2 40.64,11.11 49.22,19.68 55.25,19.68 57.79,22.22 57.79,23.48 U1.J2-12
LED4_ANODE
  Top 0.254: R4.1 LED4.2
PACK+  (via drill 0.38)
  Top 0.254: R29.1 R28.1 0.67,61.27 v0.63,61.23 | 19.22,83.5 Z4.1
  Top 0.508: 19.22,83.5 R24.2 14.92,83.5 12.06,86.36 12.06,95.88 Q3.3 16.51,100.33 17.07,100.89 23.74,100.89 C28.2
  Top 0.762: 8.25,97.16 PACK+.1
  Top 1.016: 8.25,97.16 C29.1 5.74,90.48 4.45,89.19 D5.1
  Bottom 0.254: v0.63,61.23 0.63,85.09 0.63,85.38 0.63,91.43 v3.17,93.98
  other vias: 3.17,100.33 3.17,99.06 3.17,97.79 3.17,96.52 3.17,95.25 10.79,93.98 10.79,95.25 10.79,96.52 10.79,97.79 10.79,99.06 10.79,100.33
  pour Top (no thermals): 16.87,98.93 12.95,98.93 arc-90 12.32,99.57 12.32,100.51 arc90 11.68,101.14 3.68,101.14 arc90 2.41,99.87 2.41,94.44 arc90 3.68,93.17 12.29,93.17 12.29,94.26 arc-90 12.93,94.89 16.23,94.89 arc90 17.5,96.16 17.5,98.3 arc90
  pour Bottom (no thermals): 16.87,98.93 12.95,98.93 arc-90 12.32,99.57 12.32,100.51 arc90 11.68,101.14 3.68,101.14 arc90 2.41,99.87 2.41,94.44 arc90 3.68,93.17 11.66,93.17 arc90 12.29,93.8 12.29,94.26 arc-90 12.93,94.89 16.23,94.89 arc90 17.5,96.16 17.5,98.3 arc90
PACK_ESDP
  Top 1.016: C30.1 C29.2
PACK_GND  (via drill 0.38)
  Top 0.508: 21.82,74.31 RS2.2 22.86,76.58 23.5,75.95 23.5,71.37 | 21.82,71.37 RS1.2 22.86,72.01 23.5,71.37 | 23.5,71.37 R17.1
  Top 0.762: 8.25,74.3 PACK-.1
  Top 1.016: 8.25,74.3 C30.2 5.88,83.5 D5.2
  other vias: 10.79,71.12 10.79,72.39 10.79,73.66 10.79,74.93 10.79,76.2 10.79,77.47 3.17,77.47 3.17,76.2 3.17,74.93 3.17,73.66 3.17,72.39 3.17,71.12 20.32,77.47 20.32,76.2 20.32,74.93 20.32,73.66 20.32,72.39 20.32,71.12
  pour Top (no thermals): 2.54,77.01 2.54,71.58 arc90 3.81,70.31 22.53,70.31 22.53,78.28 3.81,78.28 arc90
  pour Bottom (no thermals): 2.54,77.01 2.54,71.58 arc90 3.81,70.31 24.49,70.31 24.49,78.28 3.81,78.28 arc90
PS1_BST
  Top 0.508: PS1.6 67.34,62.87 67.34,63.85 C3.2
PS1_SW
  Top 0.254: 70.97,58.69 L1.1 71.12,58.06
  Top 0.508: PS1.5 69.34,60.33 70.97,58.69 | 71.12,58.06 71.12,60.96 71.12,62.55 C3.1
  pour Top (no thermals): 66.8,60.6 68.91,60.6 68.91,64.87 70.15,64.87 72.06,62.97 72.06,54.76 68.91,54.76 68.91,60.05 66.8,60.05
PS_VIN
  Top 0.508: PS1.2 PS1.3 64.1,58.73 C1.1 D1.1
Q1_GATE
  Top 0.254: R6.2 53.98,13.34 53.34,12.7 53.34,8.76 | R5.1 53.34,7.31 53.34,8.76 | Q1.1 53.35,8.76 53.34,8.76
REG18
  Top 0.254: C24.1 15.88,64.9 19.05,61.72 19.05,60.33 18.62,59.9 IC1.24
SD_3.3V
  Top 0.254: Q1.3 57.15,8.26 | C7.2 54.93,10.47 55.88,9.53 56.52,9.53 57.15,8.89 57.15,8.26 | J1.P4 64.99,10.79 63.5,10.79 60.96,8.26 57.15,8.26
SD_ENABLE  (via drill 0.38)
  Top 0.254: R6.1 v58.42,13.34 | v59.05,42.55 55.23,46.37 U1.J3-11
  Bottom 0.254: v58.42,13.34 59.05,13.97 v59.05,42.55
SPI_CS
  Top 0.254: J1.P2 67.72,8.67 74.3,15.24 74.3,25.4 52.69,47 U1.J3-10
SPI_SCK
  Top 0.254: J1.P5 65.96,11.97 69.22,15.23 69.22,26.67 50.15,45.73 U1.J3-9
SPI_SDI
  Top 0.254: J1.P3 66.28,9.77 73.03,16.51 73.03,19.05 71.75,20.32 71.75,26.04 52.7,45.09 51.44,46.36 51.44,49.53 50.8,50.16 46.99,50.16 46.36,49.53 46.36,47.62 45.72,46.99 33.01,46.99 32.37,47.62 U1.J3-2
SPI_SDO
  Top 0.254: J1.P7 66.11,14.17 66.67,14.73 66.67,27.3 47.61,46.37 U1.J3-8
SRN
  Top 0.254: C21.1 R17.2 | 23.85,59.73 C18.2 23.82,58.74 22.98,57.9 22.84,57.9 arc-90 22.56,58.19 22.56,58.44 arc90 22.27,58.73 22.15,58.73 arc90 21.86,58.44 21.86,58.19 arc-90 21.58,57.9 21.46,57.9 arc-90 21.17,58.19 21.17,58.44 arc90 20.89,58.73 20.77,58.73 arc90 20.48,58.44 20.48,58.19 arc-90 20.19,57.9 IC1.20
  Top 0.508: R17.2 23.5,62.66 23.87,62.29 C19.2 23.85,62.19 23.85,59.73
SRP
  Top 0.254: R16.2 C8.2 | C18.1 25.71,58.73 23.88,56.9 IC1.18
  Top 0.508: C18.1 25.69,59.72 25.71,59.74 C19.1 26.04,62.55 R16.2
TS1  (via drill 0.38)
  Top 0.254: v27.94,55.88 29.53,55.88 C23.1 30.17,56.52 TS1.1 | v19.69,59.05 19.03,58.4 IC1.21
  Bottom 0.254: v19.69,59.05 22.23,59.05 25.4,55.88 v27.94,55.88
TS3  (via drill 0.38)
  Top 0.254: IC1.23 18.89,59.4 19.69,60.2 v19.69,62.23 | v13.97,64.13 13.02,64.13 C25.1 5.4,65.09 TS2.1
  Bottom 0.254: v19.69,62.23 17.78,64.13 v13.97,64.13
VC0
  Top 0.254: R14.2 14.29,4.76 16.19,6.67 C17.1 18.1,6.67 22.23,10.79 22.23,17.04 D3.1 | Z2.1 27.68,18.31 D3.1 | IC1.16 19.73,55.9 23.5,52.13 D3.1
VC1
  Top 0.254: C15.1 C14.2 | R13.2 14.29,9.84 16.19,11.75 C15.1 | IC1.15 19.31,55.4 22.86,51.85 22.86,19.3 20.96,17.4 20.96,14.61 18.1,11.75 C15.1
VC2
  Top 0.254: C14.1 C13.2 | R12.2 14.29,14.92 16.19,16.82 C14.1 | IC1.14 18.95,54.9 22.23,51.63 22.23,24.13 22.23,23.81 22.23,20.95 18.1,16.82 C14.1
VC3
  Top 0.254: C13.1 C12.2 | R11.2 14.29,20 16.19,21.9 C13.1 | IC1.13 18.64,54.4 21.59,51.45 21.59,28.26 21.59,25.4 18.1,21.9 C13.1
VC4
  Top 0.254: C12.1 C11.2 | R10.2 14.29,25.08 16.19,26.98 C12.1 | IC1.12 16.09,51.64 20.96,46.77 20.96,29.84 18.1,26.98 C12.1
VC5
  Top 0.254: R9.2 14.29,30.16 16.19,32.07 C11.1 | IC1.10 15.08,51.59 20.32,46.36 20.32,34.29 18.1,32.07 C11.1 | C10.2 C11.1
VC9
  Top 0.254: C10.1 C9.2 | R8.2 14.29,35.24 16.19,37.15 C10.1 | IC1.2 11.08,51.91 11.43,51.56 12.06,51.56 | IC1.8 14.08,51.57 | 14.08,51.57 19.69,45.97 19.69,38.73 18.1,37.15 C10.1 | IC1.4 12.08,51.58 12.06,51.56 | 12.06,51.56 13.08,51.56 | 13.08,51.56 14.07,51.56 14.08,51.57 | IC1.6 13.08,51.57 13.08,51.56
VC10
  Top 0.254: R7.2 14.29,40.32 16.19,42.23 C9.1 18.1,42.23 19.05,43.18 19.05,45.59 13.84,50.8 10.16,50.8 7.62,53.34 7.62,53.98 8.04,54.4 IC1.48

### Text on the board
tNames: P+ | B+ | B- | P- | Luis Serafim / BMSi v2 / 12/08/2023 | B7 | B6 | B5 | B4 | B3 | B2 | B1 | 100% | 75% | 50% | 25% | B-